# Altium schematic sheet TX_fsi6.SchDoc
size A2
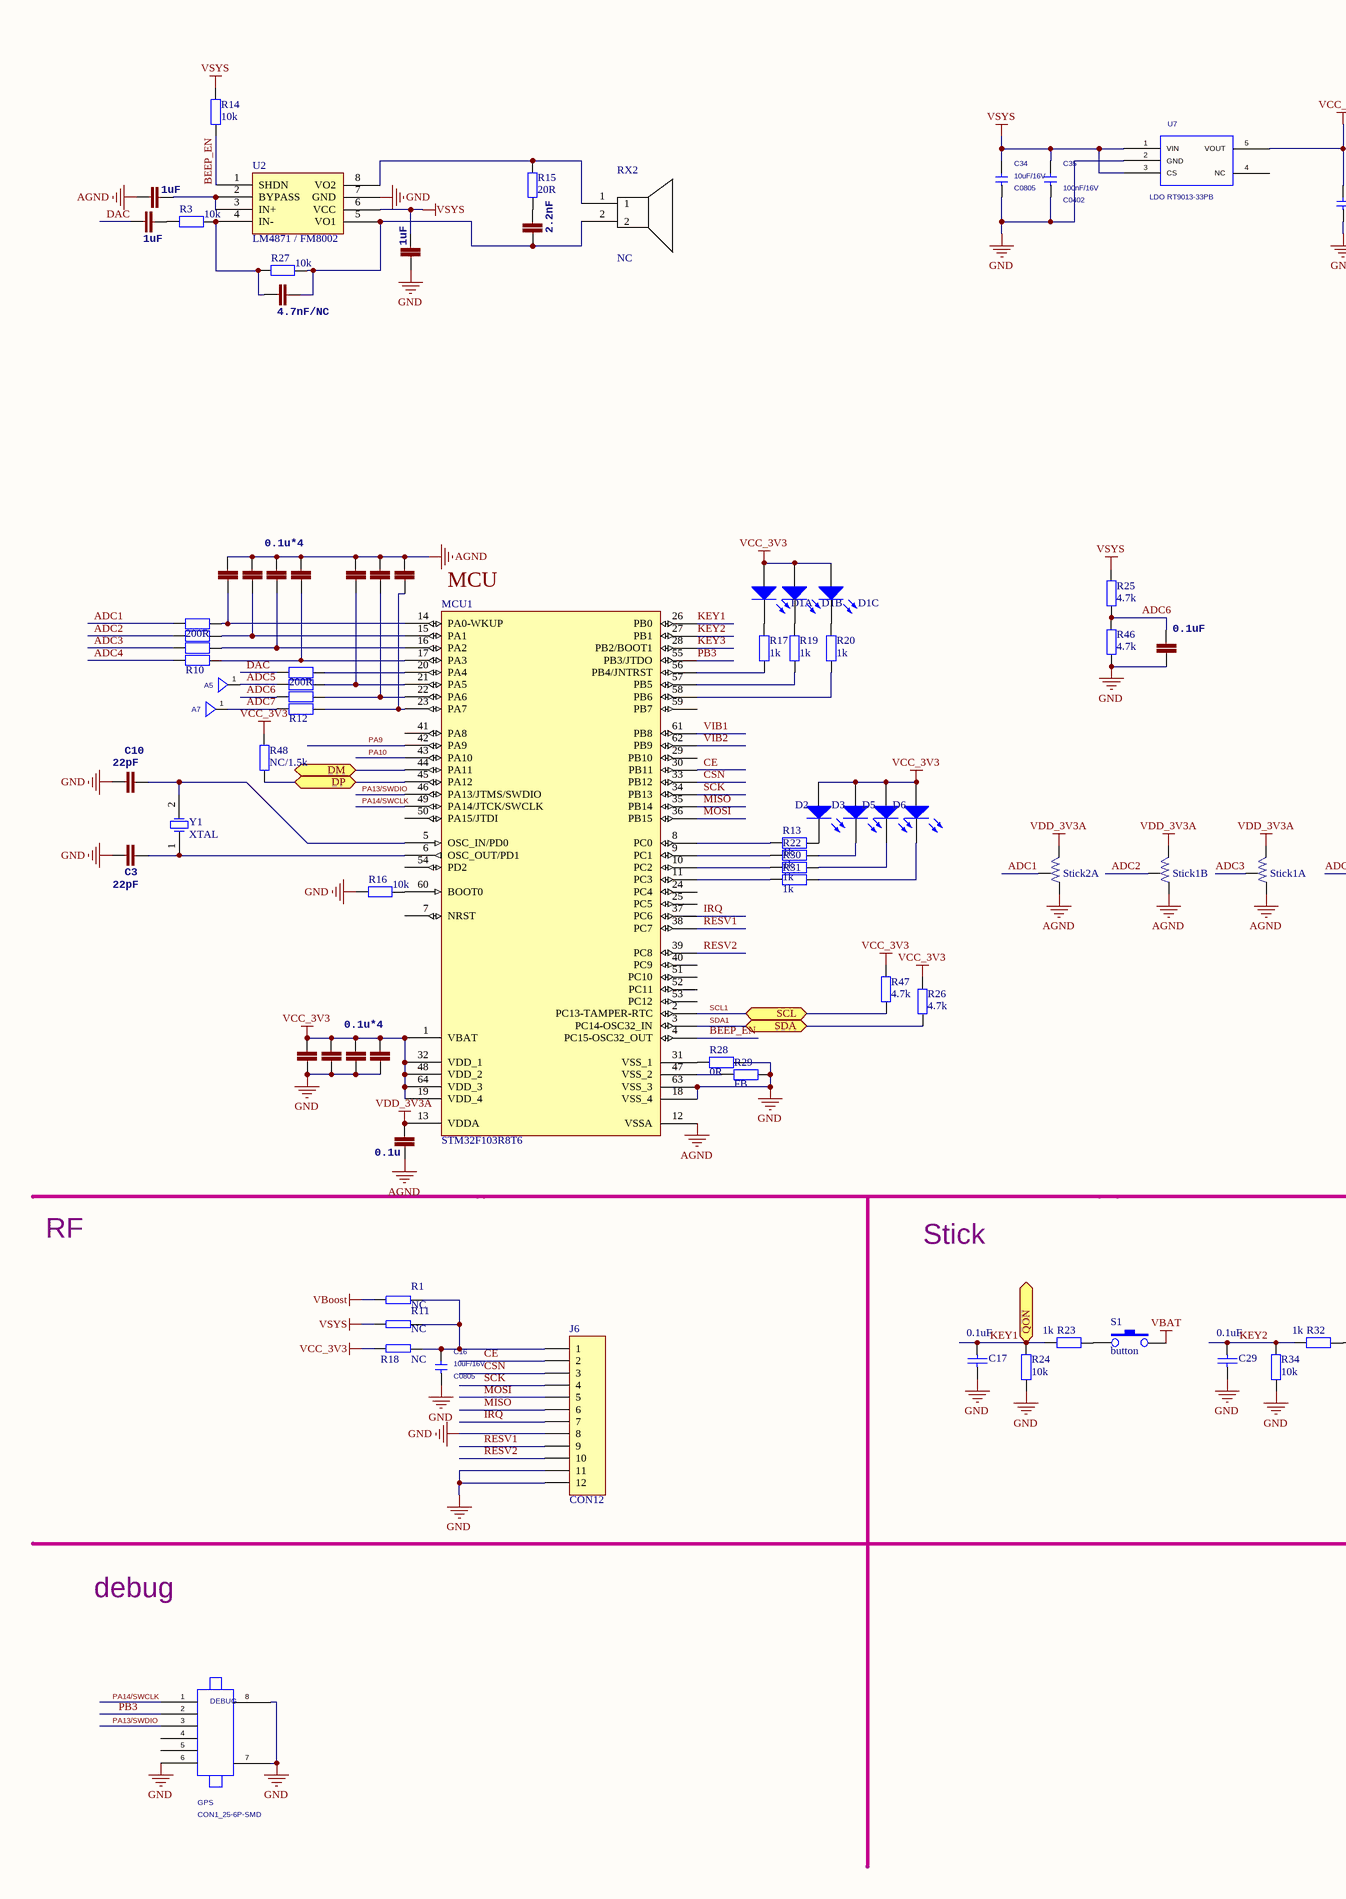
[diagram p0: TX_fsi6.SchDoc, left]
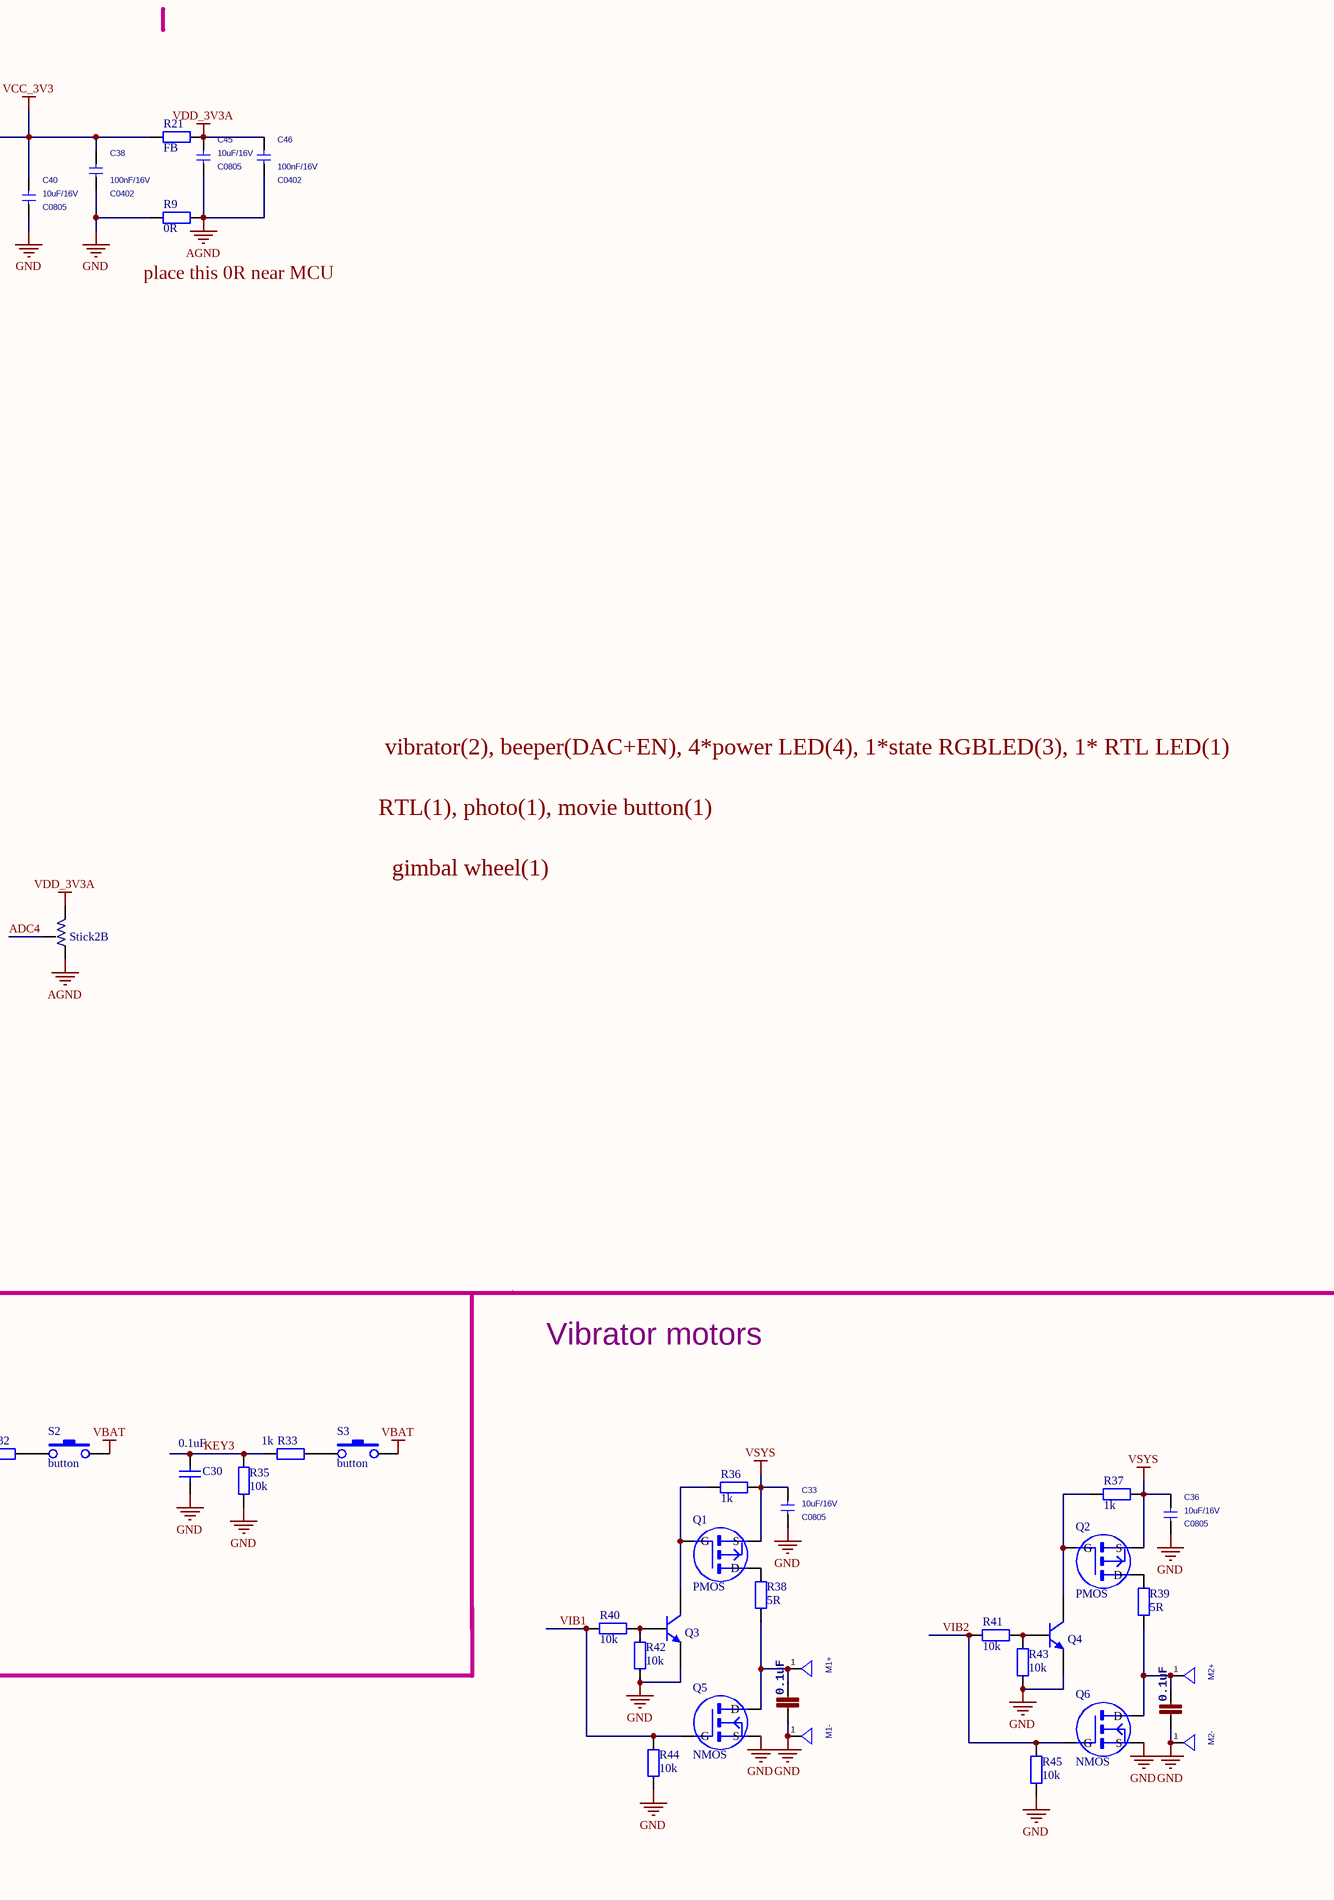
[diagram p1: TX_fsi6.SchDoc, right]

## Parts
A5  (no value)  [TestPad - 1mm]
A7  (no value)  [TestPad - 1mm]
C3  22pF  [0402]
C7  1n  [0402]  (value not drawn)
C8  1n  [0402]  (value not drawn)
C9  1n  [0402]  (value not drawn)
C10  22pF  [0402]
C11  0.1u*4  [0402]
C12  0.1u  [0402]
C16  value 10uF/16V  PCB DECAL: C0805  [0805]  (hidden comment: C)
C17  0.1uF  [0402]
C18  0.1u*4  [0402]
C19  1n  [0402]  (value not drawn)
C20  1n  [0402]  (value not drawn)
C21  1n  [0402]  (value not drawn)
C22  1n  [0402]  (value not drawn)
C23  1n  [0402]  (value not drawn)
C24  1n  [0402]  (value not drawn)
C25  1uF  [0603]
C26  1uF  [0603]
C27  4.7nF/NC  [0402]
C28  1uF  [0603]
C29  0.1uF  [0402]
C30  0.1uF  [0402]
C32  2.2nF  [0402]
C33  value 10uF/16V  PCB DECAL: C0805  [0805]  (hidden comment: C)
C34  value 10uF/16V  PCB DECAL: C0805  [0805]  (hidden comment: C)
C35  value 100nF/16V  PCB DECAL: C0402  [0603]  (hidden comment: C)
C36  value 10uF/16V  PCB DECAL: C0805  [0805]  (hidden comment: C)
C37  0.1uF  [0603]
C38  value 100nF/16V  PCB DECAL: C0402  [0603]  (hidden comment: C)
C39  0.1uF  [0603]
C40  value 10uF/16V  PCB DECAL: C0805  [0805]  (hidden comment: C)
C41  0.1uF  [0402]
C45  value 10uF/16V  PCB DECAL: C0805  [0805]  (hidden comment: C)
C46  value 100nF/16V  PCB DECAL: C0402  [0603]  (hidden comment: C)
D1  LEDx3  [LC-0603_Rx2]  (value not drawn)  (parts A,B,C of 3)
D2  LED0  [0603]  (value not drawn)
D3  LED0  [0603]  (value not drawn)
D5  LED0  [0603]  (value not drawn)
D6  LED0  [0603]  (value not drawn)
DEBUG  value GPS  [CON1_25-6P-SMD]  (hidden comment: J12)
J6  CON12  [RF_AS01_SPIPX]
M1+  (no value)  [TestPad]
M1-  (no value)  [TestPad]
M2+  (no value)  [TestPad]
M2-  (no value)  [TestPad]
MCU1  STM32F103R8T6  [LQFP64_N]
Q1  PMOS  [SOT-23B_L]
Q2  PMOS  [SOT-23B_L]
Q3  NPN  [SOT-23B_L]  (value not drawn)
Q4  NPN  [SOT-23B_L]  (value not drawn)
Q5  NMOS  [SOT-23B_L]
Q6  NMOS  [SOT-23B_L]
R1  NC  [0603]
R3  10k  [0402]
R9  0R  [0402]
R10  200R  [0402X4]
R11  NC  [0603]
R12  200R  [0402X4]
R13  1k  [0402]
R14  10k  [0402]
R15  20R  [0402]
R16  10k  [0402]
R17  1k  [0402]
R18  NC  [0603]
R19  1k  [0402]
R20  1k  [0402]
R21  FB  [0402]
R22  1k  [0402]
R23  1k  [0402]
R24  10k  [0402]
R25  4.7k  [0402]
R26  4.7k  [0402]
R27  10k  [0402]
R28  0R  [0402]
R29  FB  [0402]
R30  1k  [0402]
R31  1k  [0402]
R32  1k  [0402]
R33  1k  [0402]
R34  10k  [0402]
R35  10k  [0402]
R36  1k  [0402]
R37  1k  [0402]
R38  5R  [0603]
R39  5R  [0603]
R40  10k  [0402]
R41  10k  [0402]
R42  10k  [0402]
R43  10k  [0402]
R44  10k  [0402]
R45  10k  [0402]
R46  4.7k  [0402]
R47  4.7k  [0402]
R48  NC/1.5k  [0402]
RX2  NC  [sonar-10mm]
S1  button  [RubberButton-8mm]
S2  button  [RubberButton-8mm]
S3  button  [RubberButton-8mm]
Stick1  stick  [stick]  (value not drawn)  (parts A,B of 2)
Stick2  stick  [stick]  (value not drawn)  (parts A,B of 2)
U2  LM4871 / FM8002  [SOIC8_39MM]
U7  value LDO RT9013-33PB  [SOT23-5]  (hidden comment: RT9193-33_1_2)
Y1  XTAL  [OSCILLATOR-3.2X2.5 - 2P]

## Ports
DM, DP, QON, SCL, SDA

## Nets
AGND: C12.1 C18.2 C19.2 C20.2 C21.2 C22.2 C23.2 C24.2 C25.2 C45.2 C46.2 MCU1.12(VSSA) R9.1 Stick1.3 Stick1.6 Stick2.3 Stick2.6
GND: C3.2 C7.1 C8.1 C9.1 C10.2 C11.1 C16.2 C17.2 C28.2 C29.2 C30.2 C33.2 C34.2 C35.2 C36.2 C37.2 C38.2 C39.2 C40.2 C41.1 DEBUG.6 DEBUG.7 DEBUG.8 J6.8 J6.11 J6.12 M1-.1 M2-.1 MCU1.18(VSS_4) MCU1.63(VSS_3) Q3.2(E) Q4.2(E) Q5.S Q6.S R9.2 R16.1 R24.1 R28.1 R29.1 R34.1 R35.1 R42.1 R43.1 R44.1 R45.1 R46.1 U2.7(GND) U7.2(GND)
VBAT: S1.2 S2.2 S3.2
VBoost: R1.2
VCC_3V3: C7.2 C8.2 C9.2 C11.2 C38.1 C40.1 D1.1(A) D2.1(A) D3.1(A) D5.1(A) D6.1(A) MCU1.1(VBAT) MCU1.19(VDD_4) MCU1.32(VDD_1) MCU1.48(VDD_2) MCU1.64(VDD_3) R18.2 R21.2 R26.2 R47.2 R48.2 U7.5(VOUT)
VDD_3V3A: C12.2 C45.1 C46.1 MCU1.13(VDDA) R21.1 Stick1.1 Stick1.4 Stick2.1 Stick2.4
VSYS: C28.1 C33.1 C34.1 C35.1 C36.1 Q1.S Q2.S R11.2 R14.2 R25.2 R36.1 R37.1 U2.6(VCC) U7.1(VIN) U7.3(CS)
ADC1: R10.1 Stick2.2
ADC2: R10.2 Stick1.5
ADC3: R10.3 Stick1.2
ADC4: R10.4 Stick2.5
ADC5: A5.1 R12.2
ADC6: C41.2 R12.3 R25.1 R46.2
ADC7: A7.1 R12.4
BEEP_EN: MCU1.4(PC15-OSC32_OUT) R14.1 U2.1(SHDN)
CE: J6.2 MCU1.30(PB11)
CSN: J6.3 MCU1.33(PB12)
DAC: C26.2 R12.1
DM: MCU1.44(PA11) ; port DM
DP: MCU1.45(PA12) R48.1 ; port DP
IRQ: J6.7 MCU1.37(PC6)
KEY1: C17.1 MCU1.26(PB0) R23.1 R24.2 ; port QON
KEY2: C29.1 MCU1.27(PB1) R32.1 R34.2
KEY3: C30.1 MCU1.28(PB2/BOOT1) R33.1 R35.2
MISO: J6.6 MCU1.35(PB14)
MOSI: J6.5 MCU1.36(PB15)
PA9: MCU1.42(PA9)
PA10: MCU1.43(PA10)
PA13/SWDIO: DEBUG.3 MCU1.46(PA13/JTMS/SWDIO)
PA14/SWCLK: DEBUG.1 MCU1.49(PA14/JTCK/SWCLK)
PB3: DEBUG.2 MCU1.55(PB3/JTDO)
RESV1: J6.9 MCU1.38(PC7)
RESV2: J6.10 MCU1.39(PC8)
SCK: J6.4 MCU1.34(PB13)
SCL1: MCU1.2(PC13-TAMPER-RTC) R47.1 ; port SCL
SDA1: MCU1.3(PC14-OSC32_IN) R26.1 ; port SDA
VIB1: MCU1.61(PB8) Q5.G R40.2 R44.2
VIB2: MCU1.62(PB9) Q6.G R41.2 R45.2
NetC3_1: C3.1 MCU1.6(OSC_OUT/PD1) Y1.1(OSC1)
NetC10_1: C10.1 MCU1.5(OSC_IN/PD0) Y1.2(OSC2)
NetC16_1: C16.1 J6.1 R1.1 R11.1 R18.1
NetC18_1: C18.1 MCU1.14(PA0-WKUP) R10.8
NetC19_1: C19.1 MCU1.15(PA1) R10.7
NetC20_1: C20.1 MCU1.16(PA2) R10.6
NetC21_1: C21.1 MCU1.17(PA3) R10.5
NetC22_1: C22.1 MCU1.21(PA5) R12.7
NetC23_1: C23.1 MCU1.22(PA6) R12.6
NetC24_1: C24.1 MCU1.23(PA7) R12.5
NetC25_1: C25.1 U2.2(BYPASS) U2.3(IN+)
NetC26_1: C26.1 R3.1
NetC27_1: C27.1 C32.2 R27.2 RX2.2 U2.5(VO1)
NetC27_2: C27.2 R3.2 R27.1 U2.4(IN-)
NetC32_1: C32.1 R15.1
NetC37_1: C37.1 M1+.1 Q5.D R38.1
NetC39_1: C39.1 M2+.1 Q6.D R39.1
NetD1_2: D1.2(K) R17.2
NetD1_3: D1.3(K) R19.2
NetD1_4: D1.4(K) R20.2
NetD2_2: D2.2(K) R13.1
NetD3_2: D3.2(K) R22.1
NetD5_2: D5.2(K) R30.1
NetD6_2: D6.2(K) R31.1
NetMCU1_8: MCU1.8(PC0) R13.2
NetMCU1_9: MCU1.9(PC1) R22.2
NetMCU1_10: MCU1.10(PC2) R30.2
NetMCU1_11: MCU1.11(PC3) R31.2
NetMCU1_20: MCU1.20(PA4) R12.8
NetMCU1_31: MCU1.31(VSS_1) R28.2
NetMCU1_47: MCU1.47(VSS_2) R29.2
NetMCU1_56: MCU1.56(PB4/JNTRST) R17.1
NetMCU1_57: MCU1.57(PB5) R19.1
NetMCU1_58: MCU1.58(PB6) R20.1
NetMCU1_60: MCU1.60(BOOT0) R16.2
NetQ1_D: Q1.D R38.2
NetQ1_G: Q1.G Q3.3(C) R36.2
NetQ2_D: Q2.D R39.2
NetQ2_G: Q2.G Q4.3(C) R37.2
NetQ3_1: Q3.1(B) R40.1 R42.2
NetQ4_1: Q4.1(B) R41.1 R43.2
NetR15_2: R15.2 RX2.1 U2.8(VO2)
NetR23_2: R23.2 S1.1
NetR32_2: R32.2 S2.1
NetR33_2: R33.2 S3.1

Not connected (* = marked no-connect by the designer): DEBUG 4 5; MCU1 7(NRST) 24(PC4) 25(PC5) 29(PB10) 40(PC9) 41(PA8) 50(PA15/JTDI) 51(PC10) 52(PC11) 53(PC12) 54(PD2) 59(PB7); U7 4(NC)

## Notes on the sheet
- (near R9) place this 0R near MCU
- MCU
- vibrator(2), beeper(DAC+EN), 4*power LED(4), 1*state RGBLED(3), 1* RTL LED(1)
- RTL(1), photo(1), movie button(1)
- gimbal wheel(1)
- RF
- Stick
- Vibrator motors
- debug

## Library data of the parts
A5 A7 M1+ M1- M2+ M2- = TP_5: Value: TestPoint; PCB DECAL: TEST_PIN; Source_Path: C:\USERS\EULER-SJ\DESKTOP\CHEN-PI2\CHEN-PI2\MAIN_BOARD\SV607_MAIN_V3_20160131_NETLIST.DSN
C3 C7-C12 C18-C28 C32 C37 C39 C41 = CAP0402-CAP: <b>Capacitor</b> / Standard 0603 ceramic capacitor, and 0.1" leaded capacitor.; PARTNO: CC0402ZRY5V7BB104
C16 C33-C36 C38 C40 C45 C46 = C: Source_Path: C:\USERS\EULER-SJ\DESKTOP\CHEN-PI2\LIBRARY1.OLB; PSpiceTemplate: C^@REFDES %1 %2 ?TOLERANCE|C^@REFDES| @VALUE ?IC/IC=@IC/ ?TOLERANCE|\n.model C^@REFDES CAP C=1 DEV=@TOLERANCE%|
C17 C29 C30 = Cap: Capacitor; Published: 8-Jun-2000; LatestRevisionDate: 17-Jul-2002; LatestRevisionNote: Re-released for DXP Platform.; PackageReference: RAD-0.3; Publisher: Altium Limited; PackageDescription: Radial Cap, Thru-Hole; 2 Leads; 0.3 in Pin Spacing
D1 = LEDx3: Typical RED GaAs LED; Published: 8-Jun-2000; LatestRevisionDate: 08-Jul-2005; LatestRevisionNote: Mech Layer 1 removed.; PackageReference: LED-1; Publisher: Altium Limited; PackageDescription: LED; 2 Leads
D2 D3 D5 D6 = LED0: Typical INFRARED GaAs LED; Published: 8-Jun-2000; LatestRevisionDate: 08-Jul-2005; LatestRevisionNote: Mech Layer 1 removed.; PackageReference: LED-0; Publisher: Altium Limited; PackageDescription: LED; 2 Leads
DEBUG = J12: Source_Path: C:\USERS\EULER-SJ\DESKTOP\CHEN-PI2\LIBRARY1.OLB; PCB DECAL: CON1_25-6P-SMD
J6 = CON12: Connector
MCU1 = STM32F103R8T6: STM32 ARM-based 32-bit MCU with 64 Kbytes Flash, 64-pin LQFP, Industrial Temperature; Published: *; DatasheetVersion: *; PackageVersion: *; PackageReference: *; Publisher: *; PackageDescription: *; ComponentLink1Description: *; ComponentLink1URL: *; ComponentLink2Description: *; ComponentLink2URL: *
Q1 Q2 = PMOS: pin to pad: D>3 G>1 S>2
Q3 Q4 = NPN: NPN Bipolar Transistor; Published: 8-Jun-2000; LatestRevisionDate: 29-May-2009; LatestRevisionNote: IPC-7351 Footprint Added.; PackageVersion: Aug-1999; PackageReference: SOT-23B; Publisher: Altium Limited; PackageDescription: 3-Pin SOT-23 Package 0.95 mm Pitch, 2.4 mm Lead Span
Q5 Q6 = NMOS: pin to pad: D>3 G>1 S>2
R1 R11 R18 = Res
R3 R13-R17 R19 R20 R22 R27 R30 R31 = Res2: Resistor; Value: 0Ohm; Published: 8-Jun-2000; LatestRevisionDate: 17-Jul-2002; LatestRevisionNote: Re-released for DXP Platform.; PackageReference: AXIAL-0.4; Publisher: Altium Limited; PackageDescription: Axial Device, Thru-Hole; 2 Leads; 0.4 in Pin Spacing
R9 R21 R28 R29 R36 R37 R40 R41 R44 R45 = Res2: Resistor; Published: 8-Jun-2000; LatestRevisionDate: 17-Jul-2002; LatestRevisionNote: Re-released for DXP Platform.; PackageReference: AXIAL-0.4; Publisher: Altium Limited; PackageDescription: Axial Device, Thru-Hole; 2 Leads; 0.4 in Pin Spacing
R10 R12 = Res*4: Resistor; Value: 0Ohm; Published: 8-Jun-2000; LatestRevisionDate: 17-Jul-2002; LatestRevisionNote: Re-released for DXP Platform.; PackageReference: AXIAL-0.4; Publisher: Altium Limited; PackageDescription: Axial Device, Thru-Hole; 2 Leads; 0.4 in Pin Spacing
R23-R26 R32-R35 R38 R39 R42 R43 R46-R48 = Res2: Resistor; Value: 22k 1%; Published: 8-Jun-2000; LatestRevisionDate: 17-Jul-2002; LatestRevisionNote: Re-released for DXP Platform.; PackageReference: AXIAL-0.4; Publisher: Altium Limited; PackageDescription: Axial Device, Thru-Hole; 2 Leads; 0.4 in Pin Spacing
RX2 = sonar
U2 = LM4871
U7 = RT9193-33_1_2: Part_No_: 1; Source_Path: W:\PROJECT\JOVI\NT96650\REFERENCE CIRCUIT\NT96650ES_PANA34110.DSN; PCB DECAL: SOT23-5
Y1 = XTAL: Crystal Oscillator; Published: 8-Jun-2000; LatestRevisionDate: 17-Jul-2002; LatestRevisionNote: Re-released for DXP Platform.; PackageReference: R38; Publisher: Altium Limited; PackageDescription: Crystal, Thru-Hole; 2 Leads; Body 3.1 x 8.2 mm (Dia.xH)